# EAGLE schematic s340k (EAGLE 6.1)
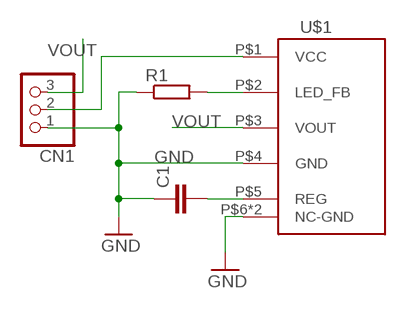
[diagram p0: schematic, sheet 1]

## Parts
C1  C-EUC0805  [C0805]
CN1  JST_3PIN  [JSTPH3]
R1  R-EU_R1206  [R1206]
U$1  340K  [SHARP_340K]

## Nets
GND: C1.1 CN1.1 R1.1 U$1.P$4(GND) U$1.P$6(NC-GND) U$1.P$7(NC-GND)
N$1: R1.2 U$1.P$2(LED_FB)
N$3: C1.2 U$1.P$5(REG)
VCC: CN1.2 U$1.P$1(VCC)
VOUT: CN1.3 U$1.P$3(VOUT)

## Library data of the parts
C1 = rcl:C-EU: CAPACITOR, European symbol
CN1 = adafruit:JST_3PIN
R1 = rcl:R-EU_: RESISTOR, European symbol
U$1 = sharp smd:340K